# Altium project AirQ.PrjPCB
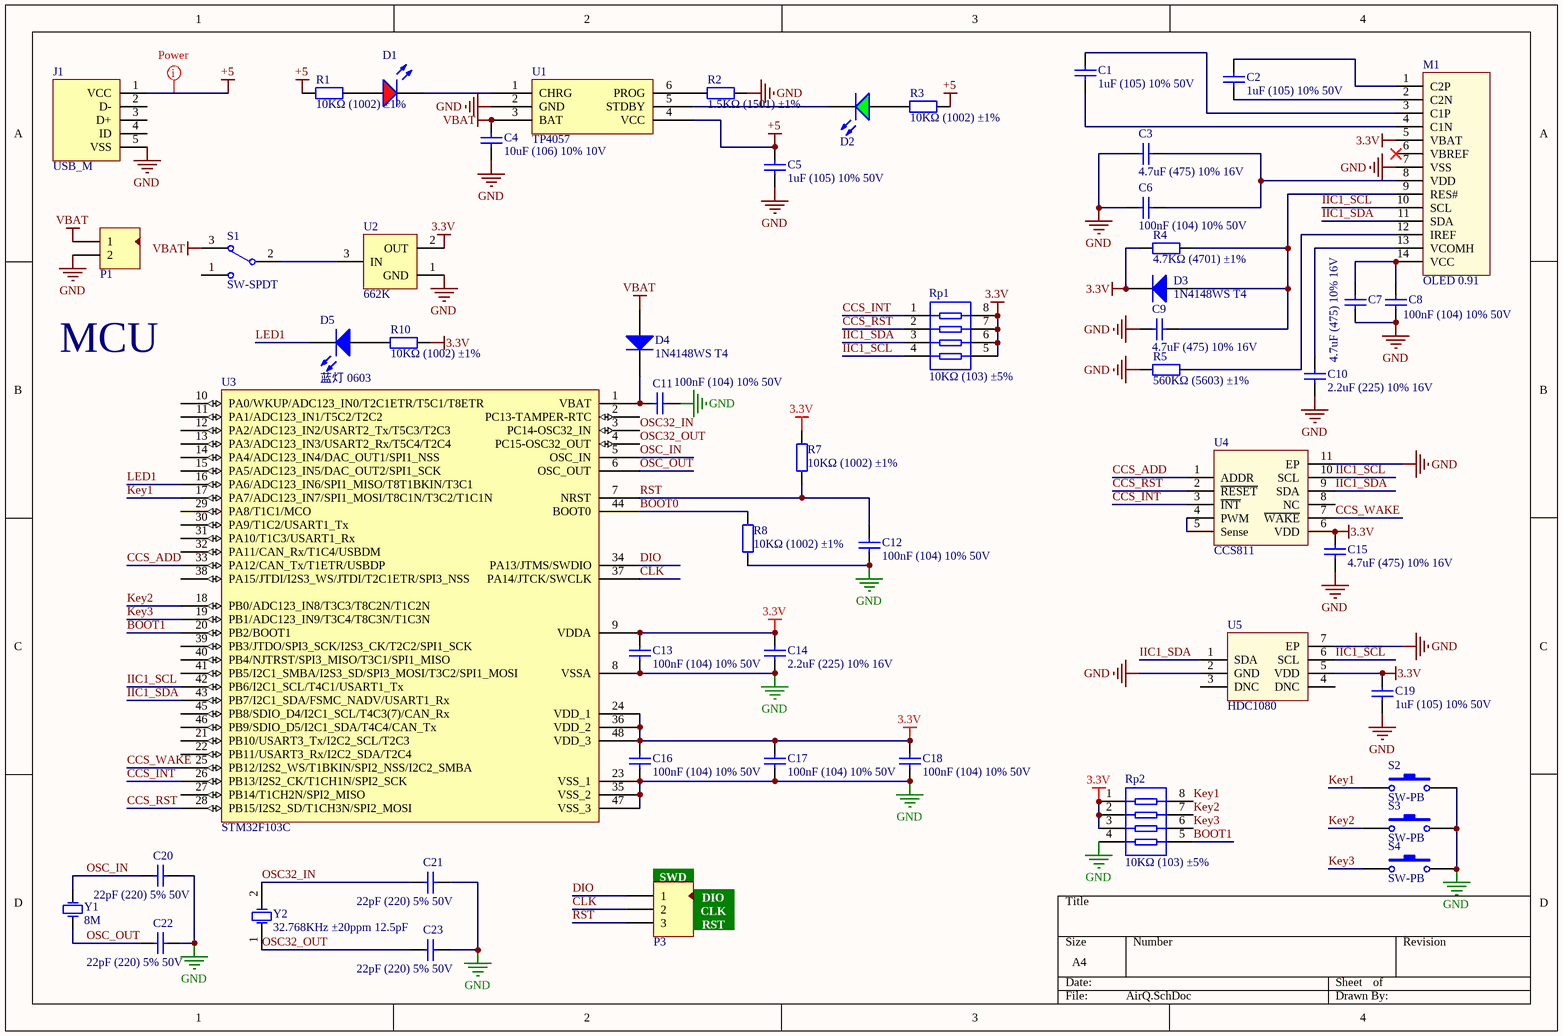
[diagram p0: AirQ.SchDoc]
1 sheet, 53 parts. Net scope: global (net labels, ports and power ports of the same name join across sheets).
Board file: AirQ.PcbDoc

## Sheet AirQ.SchDoc
size A4

### Parts
C1  1uF (105) 10% 50V  [0603_C]
C2  1uF (105) 10% 50V  [0603_C]
C3  4.7uF (475) 10% 16V  [0603_C]
C4  10uF (106) 10% 10V  [0603_C]
C5  1uF (105) 10% 50V  [0603_C]
C6  100nF (104) 10% 50V  [0603_C]
C7  4.7uF (475) 10% 16V  [0603_C]
C8  100nF (104) 10% 50V  [0603_C]
C9  4.7uF (475) 10% 16V  [0603_C]
C10  2.2uF (225) 10% 16V  [0603_C]
C11  100nF (104) 10% 50V  [0603_C]
C12  100nF (104) 10% 50V  [0603_C]
C13  100nF (104) 10% 50V  [0603_C]
C14  2.2uF (225) 10% 16V  [0603_C]
C15  4.7uF (475) 10% 16V  [0603_C]
C16  100nF (104) 10% 50V  [0603_C]
C17  100nF (104) 10% 50V  [0603_C]
C18  100nF (104) 10% 50V  [0603_C]
C19  1uF (105) 10% 50V  [0603_C]
C20  22pF (220) 5% 50V  [0603_C]
C21  22pF (220) 5% 50V  [0603_C]
C22  22pF (220) 5% 50V  [0603_C]
C23  22pF (220) 5% 50V  [0603_C]
D1  红灯 0603  [0603_LED_S1]  (value not drawn)
D2  绿灯 0603  [0603_LED_S1]  (value not drawn)
D3  1N4148WS T4  [SOD-323]
D4  1N4148WS T4  [SOD-323]
D5  蓝灯 0603  [0603_LED_S1]
J1  USB_M  [USB-MICRO-A01SB141B1-261]
M1  OLED 0.91  [OLED 0.91 BOTTOM]
P1  Header 2  [HDR2X1-2.54]  (value not drawn)
P3  Header 3  [HDR3X1-2.54]  (value not drawn)
R1  10KΩ (1002) ±1%  [0603_R]
R2  1.5KΩ (1501) ±1%  [0603_R]
R3  10KΩ (1002) ±1%  [0603_R]
R4  4.7KΩ (4701) ±1%  [0603_R]
R5  560KΩ (5603) ±1%  [0603_R]
R7  10KΩ (1002) ±1%  [0603_R]
R8  10KΩ (1002) ±1%  [0603_R]
R10  10KΩ (1002) ±1%  [0603_R]
Rp1  10KΩ (103) ±5%  [0603_Rx4]
Rp2  10KΩ (103) ±5%  [0603_Rx4]
S1  SW-SPDT  [SWITCH_SMT1]
S2  SW-PB  [SW_PB2_A1]
S3  SW-PB  [SW_PB2_A1]
S4  SW-PB  [SW_PB2_A1]
U1  TP4057  [SOT-23-6]
U2  662K  [SOT23-3]
U3  STM32F103C  [LQFP-48]
U4  CCS811  [CCS811]
U5  HDC1080  [HDC1080]
Y1  value 8M  [5032 - 2Pin]  (hidden comment: XTAL)
Y2  32.768KHz ±20ppm 12.5pF  [SMD-3215_2P FC - 135]

### Nets
3.3V: C13.2 C14.2 C15.2 C16.2 C17.2 C18.2 C19.2 D3.2(K) M1.5(VBAT) R4.2 R7.2 R10.1 Rp1.5 Rp1.6 Rp1.7 Rp1.8 Rp2.1 Rp2.2 Rp2.3 U2.2(OUT) U3.9(VDDA) U3.24(VDD_1) U3.36(VDD_2) U3.48(VDD_3) U4.6(VDD) U5.5(VDD)
+5: C5.2 J1.1(VCC) R1.1 R3.1 U1.4(VCC)
GND: C3.2 C4.1 C5.1 C6.2 C7.2 C8.2 C9.1 C10.1 C11.1 C12.1 C13.1 C14.1 C15.1 C16.1 C17.1 C18.1 C19.1 C20.2 C21.2 C22.2 C23.2 J1.5(VSS) M1.7(VSS) P1.2 R2.2 R5.2 R8.1 Rp2.4 S2.2 S3.2 S4.2 U1.2(GND) U2.1(GND) U3.8(VSSA) U3.23(VSS_1) U3.35(VSS_2) U3.47(VSS_3) U4.11(EP) U5.2(GND) U5.7(EP)
VBAT: C4.2 D4.1(A) P1.1 S1.3 U1.3(BAT)
BOOT0: R8.2 U3.44(BOOT0)
BOOT1: Rp2.5 U3.20(PB2/BOOT1)
CCS_ADD: U3.33(PA12/CAN_Tx/T1ETR/USBDP) U4.1(ADDR)
CCS_INT: Rp1.1 U3.26(PB13/I2S2_CK/T1CH1N/SPI2_SCK) U4.3(~{INT})
CCS_RST: Rp1.2 U3.28(PB15/I2S2_SD/T1CH3N/SPI2_MOSI) U4.2(~{RESET})
CCS_WAKE: U3.25(PB12/I2S2_WS/T1BKIN/SPI2_NSS/I2C2_SMBA) U4.7(~{WAKE})
CLK: P3.2 U3.37(PA14/JTCK/SWCLK)
DIO: P3.1 U3.34(PA13/JTMS/SWDIO)
IIC1_SCL: M1.10(SCL) Rp1.4 U3.42(PB6/I2C1_SCL/T4C1/USART1_Tx) U4.10(SCL) U5.6(SCL)
IIC1_SDA: M1.11(SDA) Rp1.3 U3.43(PB7/I2C1_SDA/FSMC_NADV/USART1_Rx) U4.9(SDA) U5.1(SDA)
Key1: Rp2.8 S2.1 U3.17(PA7/ADC123_IN7/SPI1_MOSI/T8C1N/T3C2/T1C1N)
Key2: Rp2.7 S3.1 U3.18(PB0/ADC123_IN8/T3C3/T8C2N/T1C2N)
Key3: Rp2.6 S4.1 U3.19(PB1/ADC123_IN9/T3C4/T8C3N/T1C3N)
LED1: D5.K U3.16(PA6/ADC123_IN6/SPI1_MISO/T8T1BKIN/T3C1)
OSC32_IN: C21.1 U3.3(PC14-OSC32_IN) Y2.2(OSC2)
OSC32_OUT: C23.1 U3.4(PC15-OSC32_OUT) Y2.1(OSC1)
OSC_IN: C20.1 U3.5(OSC_IN) Y1.2(OSC2)
OSC_OUT: C22.1 U3.6(OSC_OUT) Y1.1(OSC1)
RST: C12.2 P3.3 R7.1 U3.7(NRST)
NetC1_1: C1.1 M1.4(C1N)
NetC1_2: C1.2 M1.3(C1P)
NetC2_1: C2.1 M1.2(C2N)
NetC2_2: C2.2 M1.1(C2P)
NetC3_1: C3.1 C6.1 M1.8(VDD)
NetC7_1: C7.1 C8.1 M1.14(VCC)
NetC9_2: C9.2 D3.1(A) M1.9(RES#) R4.1
NetC10_2: C10.2 M1.13(VCOMH)
NetC11_2: C11.2 D4.2(K) U3.1(VBAT)
NetD1_A: D1.A R1.2
NetD1_K: D1.K U1.1(CHRG)
NetD2_A: D2.A R3.2
NetD2_K: D2.K U1.5(STDBY)
NetD5_A: D5.A R10.2
NetM1_12: M1.12(IREF) R5.1
NetR2_1: R2.1 U1.6(PROG)
NetS1_2: S1.2 U2.3(IN)
NetU4_4: U4.4(PWM) U4.5(Sense)

Not connected (* = marked no-connect by the designer): J1 2(D-) 3(D+) 4(ID); M1 6(VBREF)*; S1 1; U3 2(PC13-TAMPER-RTC) 10(PA0/WKUP/ADC123_IN0/T2C1ETR/T5C1/T8ETR) 11(PA1/ADC123_IN1/T5C2/T2C2) 12(PA2/ADC123_IN2/USART2_Tx/T5C3/T2C3) 13(PA3/ADC123_IN3/USART2_Rx/T5C4/T2C4) 14(PA4/ADC123_IN4/DAC_OUT1/SPI1_NSS) 15(PA5/ADC123_IN5/DAC_OUT2/SPI1_SCK) 21(PB10/USART3_Tx/I2C2_SCL/T2C3) 22(PB11/USART3_Rx/I2C2_SDA/T2C4) 27(PB14/T1CH2N/SPI2_MISO) 29(PA8/T1C1/MCO) 30(PA9/T1C2/USART1_Tx) 31(PA10/T1C3/USART1_Rx) 32(PA11/CAN_Rx/T1C4/USBDM) 38(PA15/JTDI/I2S3_WS/JTDI/T2C1ETR/SPI3_NSS) 39(PB3/JTDO/SPI3_SCK/I2S3_CK/T2C2/SPI1_SCK) 40(PB4/NJTRST/SPI3_MISO/T3C1/SPI1_MISO) 41(PB5/I2C1_SMBA/I2S3_SD/SPI3_MOSI/T3C2/SPI1_MOSI) 45(PB8/SDIO_D4/I2C1_SCL/T4C3(7)/CAN_Rx) 46(PB9/SDIO_D5/I2C1_SDA/T4C4/CAN_Tx); U4 8(NC); U5 3(DNC) 4(DNC)

### Layout directives
net class Power: +5

### Notes on the sheet
- MCU
- (near P3) SWD
- (near P3) DIO
  CLK
  RST

### Library data of the parts
C1 C2 C5 C19 = 0603 1uF (105) 10% 50V: 贴片电容; ComponentLink1Description: 供应商链接; ComponentLink1URL: http://www.szlcsc.com/product/details_16531.html; Package: 0603; Supplier: LC; SuppliersPartNumber: C15849
C3 C7 C9 C15 = 0603 4.7uF (475) 10% 16V: 贴片电容; ComponentLink1Description: 供应商链接; ComponentLink1URL: http://www.szlcsc.com/product/details_20375.html; Package: 0603; Supplier: LC; SuppliersPartNumber: C19666
C4 = 0603 10uF (106) 10% 10V: 贴片电容; ComponentLink1Description: 供应商链接; ComponentLink1URL: http://www.szlcsc.com/product/details_20411.html; Package: 0603; Supplier: LC; SuppliersPartNumber: C19702
C6 C8 C11-C13 C16-C18 = 0603 100nF (104) 10% 50V: 贴片电容; ComponentLink1Description: 供应商链接; ComponentLink1URL: http://www.szlcsc.com/product/details_15331.html; Package: 0603; Supplier: LC; SuppliersPartNumber: C14663
C10 C14 = 0603 2.2uF (225) 10% 16V: 贴片电容; ComponentLink1Description: 供应商链接; ComponentLink1URL: http://www.szlcsc.com/product/details_24366.html; Package: 0603; Supplier: LC; SuppliersPartNumber: C23630
C20-C23 = 0603 22pF (220) 5% 50V: 贴片电容; ComponentLink1Description: 供应商链接; ComponentLink1URL: http://www.szlcsc.com/product/details_2005.html; Package: 0603; Supplier: LC; SuppliersPartNumber: C1653
D1 = 0603 红灯: 发光二极管; ComponentLink1Description: 供应商链接; ComponentLink1URL: http://www.szlcsc.com/product/details_2659.html; Package: 0603; Supplier: LC; SuppliersPartNumber: C2286
D2 = 0603 绿灯: 发光二极管; ComponentLink1Description: 供应商链接; ComponentLink1URL: http://www.szlcsc.com/product/details_73152.html; Package: 0603; Supplier: LC; SuppliersPartNumber: C72043
D3 D4 = SOD-323 1N4148WS T4: 二极管; ComponentLink1Description: 供应商链接; ComponentLink1URL: http://www.szlcsc.com/product/details_2485.html; Package: SOD-323; Supplier: LC; SuppliersPartNumber: C2128
D5 = 0603 蓝灯: 发光二极管; ComponentLink1Description: 供应商链接; ComponentLink1URL: http://www.szlcsc.com/product/details_73150.html; Package: 0603; Supplier: LC; SuppliersPartNumber: C72041
J1 = USB_M: Micro/Mini USB; Rule: UNIONINDEX{}0[]RULEKIND{}Clearance[]NETSCOPE{}DifferentNets[]LAYERKIND{}SameLayer[]NAME{}Schematic Clearance Constraint[]GAP{}8mil[]GENERICCLEARANCE{}8mil[]IGNOREPADTOPADCLEARANCEINFOOTPRINT{}FALSE[]OBJECTCLEARANCES{} []UNIT{}Imperial[]PcbType{}ProtelPcb; Rule: UNIONINDEX{}0[]RULEKIND{}Width[]NETSCOPE{}AnyNet[]LAYERKIND{}SameLayer[]NAME{}Schematic Width Constraint[]MAXLIMIT{}30mil[]MINLIMIT{}15mil[]PREFEREDWIDTH{}20mil[]UNIT{}Imperial[]PcbType{}ProtelPcb
M1 = OLED-0.91: 0.91寸OLED裸屏
P1 = Header 2: 接插件; LatestRevisionDate: 17-Jul-2002; LatestRevisionNote: Re-released for DXP Platform.; Publisher: Altium Limited
P3 = Header 3: 接插件; LatestRevisionDate: 17-Jul-2002; LatestRevisionNote: Re-released for DXP Platform.; Publisher: Altium Limited
R1 R3 R7 R8 R10 = 0603 10KΩ (1002) 1%: 贴片电阻; ComponentLink1Description: 供应商链接; ComponentLink1URL: http://www.szlcsc.com/product/details_26547.html; Package: 0603; Supplier: LC; SuppliersPartNumber: C25804
R2 = 0603 1.5KΩ (1501) 1%: 贴片电阻; ComponentLink1Description: 供应商链接; ComponentLink1URL: http://www.szlcsc.com/product/details_23570.html; Package: 0603; Supplier: LC; SuppliersPartNumber: C22843
R4 = 0603 4.7KΩ (4701) 1%: 贴片电阻; ComponentLink1Description: 供应商链接; ComponentLink1URL: http://www.szlcsc.com/product/details_23889.html; Package: 0603; Supplier: LC; SuppliersPartNumber: C23162
R5 = 0603 560KΩ (5603) 1%: 贴片电阻; ComponentLink1Description: 供应商链接; ComponentLink1URL: http://www.szlcsc.com/product/details_23930.html; Package: 0603; Supplier: LC; SuppliersPartNumber: C23203
Rp1 Rp2 = 0603*4  10KΩ (103) 5%: 贴片排阻; ComponentLink1Description: 供应商链接; ComponentLink1URL: http://www.szlcsc.com/product/details_30472.html; Package: 0603*4; Supplier: LC; SuppliersPartNumber: C29718
S1 = SW-SPDT: 开关; Published: 24-Mar-1999; LatestRevisionDate: 17-Dec-2003; LatestRevisionNote: Schematic revised, PCB Footprint replaced.; DatasheetDocument: 05-Dec-2000; PackageReference: TL36WW15050; Publisher: Altium Limited; ComponentLink1Description: Manufacturer Link; ComponentLink1URL: http://www.apem.com
S2-S4 = SW-PB: 微动开关; Published: 24-Mar-1999; LatestRevisionDate: 17-Jul-2002; LatestRevisionNote: Re-released for DXP Platform.; PackageReference: SPST-2; Publisher: Altium Limited
U1 = TP4057_[C12044]: 电池电源管理; ComponentLink1Description: 供应商链接; ComponentLink1URL: http://www.szlcsc.com/product/details_12599.html; Package: SOT-23-6; Supplier: LC; SuppliersPartNumber: C12044
U2 = XC6206P332MR: 3.3V稳压三极管 662K
U3 = STM32F103C: STM32单片机48引脚
U4 = CCS811: 空气质量检测
U5 = HDC1080: 温湿度传感器
Y1 = XTAL: 晶振; Published: 8-Jun-2000; LatestRevisionDate: 17-Jul-2002; LatestRevisionNote: Re-released for DXP Platform.; PackageReference: R38; Publisher: Altium Limited
Y2 = SMD-3215_2P 32.768KHz 20ppm 12.5pF: 贴片晶振; ComponentLink1Description: 供应商链接; ComponentLink1URL: http://www.szlcsc.com/product/details_33310.html; Package: SMD-3215_2P; Supplier: LC; SuppliersPartNumber: C32346